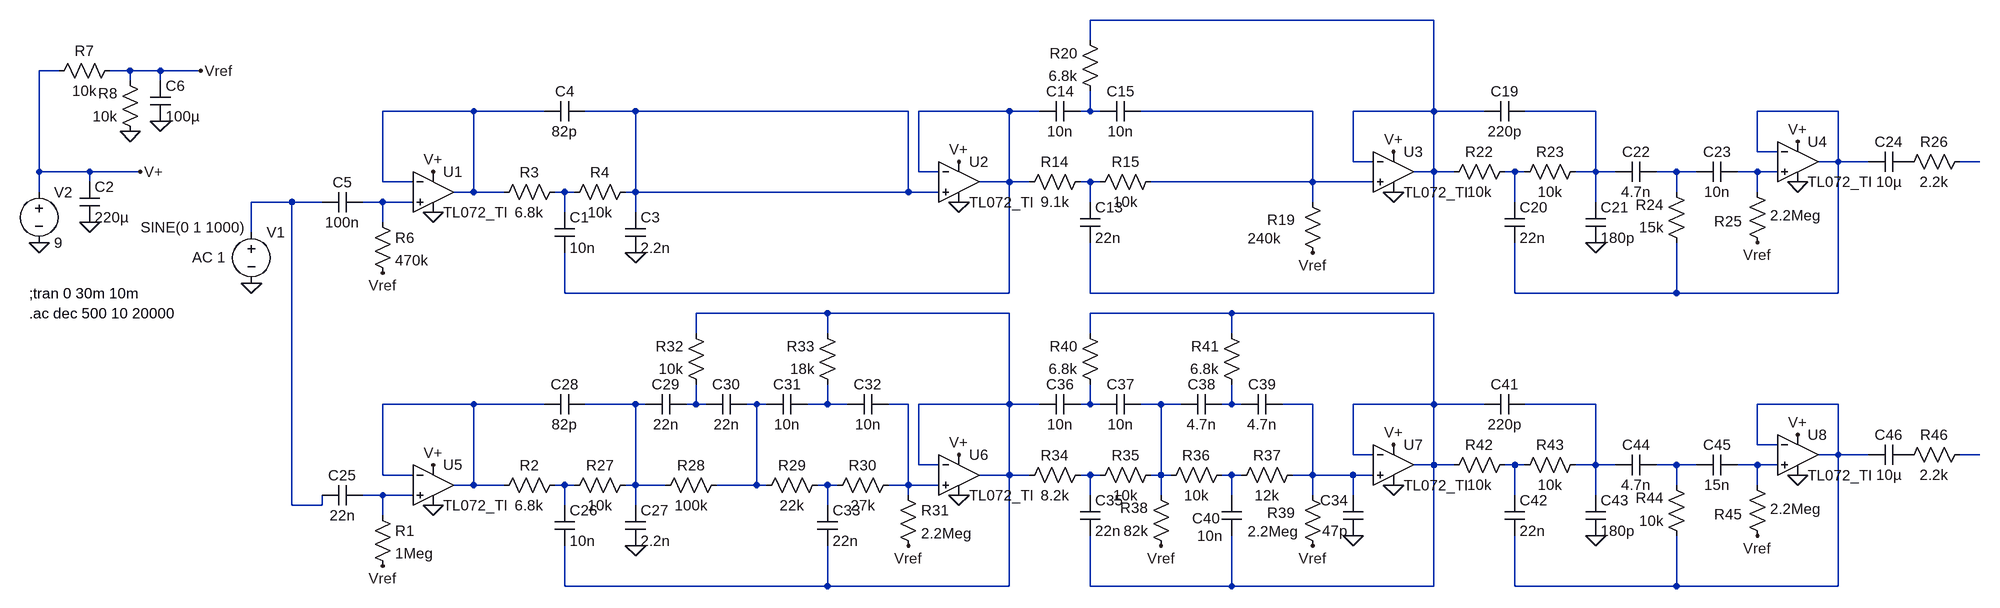
[diagram p0: schematic speakersim_true_val.asc]
speakersim_true_val.asc, the LTspice schematic file:
Version 4
SHEET 1 4328 1400
WIRE 2176 0 1632 0
WIRE 1632 32 1632 0
WIRE 0 80 -32 80
WIRE 112 80 80 80
WIRE 160 80 112 80
WIRE 224 80 160 80
WIRE 112 96 112 80
WIRE 160 96 160 80
WIRE 656 144 512 144
WIRE 768 144 656 144
WIRE 912 144 832 144
WIRE 1344 144 912 144
WIRE 1504 144 1360 144
WIRE 1552 144 1504 144
WIRE 1632 144 1632 112
WIRE 1632 144 1616 144
WIRE 1648 144 1632 144
WIRE 1984 144 1712 144
WIRE 2176 144 2176 0
WIRE 2176 144 2048 144
WIRE 2256 144 2176 144
WIRE 2432 144 2320 144
WIRE 2816 144 2688 144
WIRE 2688 208 2688 144
WIRE 2720 208 2688 208
WIRE 2048 224 2048 144
WIRE 2080 224 2048 224
WIRE 2816 224 2816 144
WIRE 2816 224 2784 224
WIRE 2864 224 2816 224
WIRE 3040 224 3008 224
WIRE -32 240 -32 80
WIRE 48 240 -32 240
WIRE 128 240 48 240
WIRE 1360 240 1360 144
WIRE 1392 240 1360 240
WIRE 2176 240 2176 144
WIRE 2176 240 2144 240
WIRE 2208 240 2176 240
WIRE 2304 240 2288 240
WIRE 2320 240 2304 240
WIRE 2432 240 2432 144
WIRE 2432 240 2400 240
WIRE 2464 240 2432 240
WIRE 2560 240 2528 240
WIRE 2592 240 2560 240
WIRE 2688 240 2656 240
WIRE 2720 240 2688 240
WIRE 48 256 48 240
WIRE 512 256 512 144
WIRE 560 256 512 256
WIRE 1504 256 1504 144
WIRE 1504 256 1456 256
WIRE 1536 256 1504 256
WIRE 1632 256 1616 256
WIRE 1648 256 1632 256
WIRE 1984 256 1984 144
WIRE 1984 256 1728 256
WIRE 2080 256 1984 256
WIRE -32 272 -32 240
WIRE 656 272 656 144
WIRE 656 272 624 272
WIRE 704 272 656 272
WIRE 800 272 784 272
WIRE 816 272 800 272
WIRE 912 272 912 144
WIRE 912 272 896 272
WIRE 1344 272 1344 144
WIRE 1344 272 912 272
WIRE 1392 272 1344 272
WIRE 2560 272 2560 240
WIRE 2688 272 2688 240
WIRE 368 288 304 288
WIRE 416 288 368 288
WIRE 512 288 480 288
WIRE 560 288 512 288
WIRE 1632 288 1632 256
WIRE 1984 288 1984 256
WIRE 2304 288 2304 240
WIRE 2432 288 2432 240
WIRE 800 304 800 272
WIRE 912 304 912 272
WIRE 512 320 512 288
WIRE 304 336 304 288
WIRE 800 432 800 368
WIRE 1504 432 1504 256
WIRE 1504 432 800 432
WIRE 1632 432 1632 352
WIRE 2176 432 2176 240
WIRE 2176 432 1632 432
WIRE 2304 432 2304 352
WIRE 2560 432 2560 352
WIRE 2560 432 2304 432
WIRE 2816 432 2816 224
WIRE 2816 432 2560 432
WIRE 1216 464 1008 464
WIRE 1504 464 1216 464
WIRE 1856 464 1632 464
WIRE 2176 464 1856 464
WIRE 1008 496 1008 464
WIRE 1216 496 1216 464
WIRE 1632 496 1632 464
WIRE 1856 496 1856 464
WIRE 656 608 512 608
WIRE 768 608 656 608
WIRE 912 608 832 608
WIRE 928 608 912 608
WIRE 1008 608 1008 576
WIRE 1008 608 992 608
WIRE 1024 608 1008 608
WIRE 1104 608 1088 608
WIRE 1120 608 1104 608
WIRE 1216 608 1216 576
WIRE 1216 608 1184 608
WIRE 1248 608 1216 608
WIRE 1344 608 1312 608
WIRE 1504 608 1504 464
WIRE 1504 608 1360 608
WIRE 1552 608 1504 608
WIRE 1632 608 1632 576
WIRE 1632 608 1616 608
WIRE 1648 608 1632 608
WIRE 1744 608 1712 608
WIRE 1776 608 1744 608
WIRE 1856 608 1856 576
WIRE 1856 608 1840 608
WIRE 1872 608 1856 608
WIRE 1984 608 1936 608
WIRE 2176 608 2176 464
WIRE 2176 608 2048 608
WIRE 2256 608 2176 608
WIRE 2432 608 2320 608
WIRE 2816 608 2688 608
WIRE 2688 672 2688 608
WIRE 2720 672 2688 672
WIRE 2048 688 2048 608
WIRE 2080 688 2048 688
WIRE 2816 688 2816 608
WIRE 2816 688 2784 688
WIRE 2864 688 2816 688
WIRE 3040 688 3008 688
WIRE 1360 704 1360 608
WIRE 1392 704 1360 704
WIRE 2176 704 2176 608
WIRE 2176 704 2144 704
WIRE 2208 704 2176 704
WIRE 2304 704 2288 704
WIRE 2320 704 2304 704
WIRE 2432 704 2432 608
WIRE 2432 704 2400 704
WIRE 2464 704 2432 704
WIRE 2560 704 2528 704
WIRE 2592 704 2560 704
WIRE 2688 704 2656 704
WIRE 2720 704 2688 704
WIRE 512 720 512 608
WIRE 560 720 512 720
WIRE 1504 720 1504 608
WIRE 1504 720 1456 720
WIRE 1536 720 1504 720
WIRE 1632 720 1616 720
WIRE 1648 720 1632 720
WIRE 1744 720 1744 608
WIRE 1744 720 1728 720
WIRE 1760 720 1744 720
WIRE 1856 720 1840 720
WIRE 1872 720 1856 720
WIRE 1984 720 1984 608
WIRE 1984 720 1952 720
WIRE 2048 720 1984 720
WIRE 2080 720 2048 720
WIRE 656 736 656 608
WIRE 656 736 624 736
WIRE 704 736 656 736
WIRE 800 736 784 736
WIRE 816 736 800 736
WIRE 912 736 912 608
WIRE 912 736 896 736
WIRE 960 736 912 736
WIRE 1104 736 1104 608
WIRE 1104 736 1040 736
WIRE 1120 736 1104 736
WIRE 1216 736 1200 736
WIRE 1232 736 1216 736
WIRE 1344 736 1344 608
WIRE 1344 736 1312 736
WIRE 1392 736 1344 736
WIRE 2560 736 2560 704
WIRE 2688 736 2688 704
WIRE 512 752 480 752
WIRE 560 752 512 752
WIRE 1344 752 1344 736
WIRE 1632 752 1632 720
WIRE 1744 752 1744 720
WIRE 1856 752 1856 720
WIRE 1984 752 1984 720
WIRE 2048 752 2048 720
WIRE 2304 752 2304 704
WIRE 2432 752 2432 704
WIRE 368 768 368 288
WIRE 416 768 416 752
WIRE 416 768 368 768
WIRE 800 768 800 736
WIRE 912 768 912 736
WIRE 1216 768 1216 736
WIRE 512 784 512 752
WIRE 800 896 800 832
WIRE 1216 896 1216 832
WIRE 1216 896 800 896
WIRE 1504 896 1504 720
WIRE 1504 896 1216 896
WIRE 1632 896 1632 816
WIRE 1856 896 1856 816
WIRE 1856 896 1632 896
WIRE 2176 896 2176 704
WIRE 2176 896 1856 896
WIRE 2304 896 2304 816
WIRE 2560 896 2560 816
WIRE 2560 896 2304 896
WIRE 2816 896 2816 688
WIRE 2816 896 2560 896
FLAG 304 416 0
FLAG -32 352 0
FLAG 128 240 V+
FLAG 48 320 0
FLAG 112 176 0
FLAG 160 160 0
FLAG 224 80 Vref
FLAG 592 240 V+
FLAG 592 304 0
FLAG 512 400 Vref
FLAG 912 368 0
FLAG 1424 224 V+
FLAG 1424 288 0
FLAG 1984 368 Vref
FLAG 2112 208 V+
FLAG 2112 272 0
FLAG 2432 352 0
FLAG 2688 352 Vref
FLAG 2752 192 V+
FLAG 2752 256 0
FLAG 592 704 V+
FLAG 592 768 0
FLAG 512 864 Vref
FLAG 912 832 0
FLAG 1424 688 V+
FLAG 1424 752 0
FLAG 1344 832 Vref
FLAG 1744 832 Vref
FLAG 1984 832 Vref
FLAG 2048 816 0
FLAG 2112 672 V+
FLAG 2112 736 0
FLAG 2432 816 0
FLAG 2688 816 Vref
FLAG 2752 656 V+
FLAG 2752 720 0
SYMBOL voltage 304 320 R0
WINDOW 123 -94 55 Left 2
WINDOW 39 0 0 Left 2
WINDOW 3 -175 8 Left 2
SYMATTR Value2 AC 1
SYMATTR Value SINE(0 1 1000)
SYMATTR InstName V1
SYMBOL voltage -32 256 R0
WINDOW 123 0 0 Left 2
WINDOW 39 0 0 Left 2
SYMATTR InstName V2
SYMATTR Value 9
SYMBOL cap 32 256 R0
SYMATTR InstName C2
SYMATTR Value 220µ
SYMBOL res 96 64 R90
WINDOW 0 0 56 VBottom 2
WINDOW 3 32 56 VTop 2
SYMATTR InstName R7
SYMATTR Value 10k
SYMBOL res 128 192 R180
WINDOW 0 36 76 Left 2
WINDOW 3 36 40 Left 2
SYMATTR InstName R8
SYMATTR Value 10k
SYMBOL cap 144 96 R0
SYMATTR InstName C6
SYMATTR Value 100µ
SYMBOL EXTRA\\AudioOpamp\\TI\\TL072_TI 592 272 R0
SYMATTR InstName U1
SYMBOL cap 480 272 R90
WINDOW 0 0 32 VBottom 2
WINDOW 3 32 32 VTop 2
SYMATTR InstName C5
SYMATTR Value 100n
SYMBOL res 496 304 R0
SYMATTR InstName R6
SYMATTR Value 470k
SYMBOL res 800 256 R90
WINDOW 0 0 56 VBottom 2
WINDOW 3 32 56 VTop 2
SYMATTR InstName R3
SYMATTR Value 6.8k
SYMBOL res 912 256 R90
WINDOW 0 0 56 VBottom 2
WINDOW 3 32 56 VTop 2
SYMATTR InstName R4
SYMATTR Value 10k
SYMBOL cap 784 304 R0
SYMATTR InstName C1
SYMATTR Value 10n
SYMBOL cap 896 304 R0
SYMATTR InstName C3
SYMATTR Value 2.2n
SYMBOL cap 832 128 R90
WINDOW 0 0 32 VBottom 2
WINDOW 3 32 32 VTop 2
SYMATTR InstName C4
SYMATTR Value 82p
SYMBOL EXTRA\\AudioOpamp\\TI\\TL072_TI 1424 256 R0
SYMATTR InstName U2
SYMBOL res 1632 240 R90
WINDOW 0 0 56 VBottom 2
WINDOW 3 32 56 VTop 2
SYMATTR InstName R14
SYMATTR Value 9.1k
SYMBOL res 1744 240 R90
WINDOW 0 0 56 VBottom 2
WINDOW 3 32 56 VTop 2
SYMATTR InstName R15
SYMATTR Value 10k
SYMBOL res 1968 272 R0
WINDOW 0 -56 44 Left 2
WINDOW 3 -87 73 Left 2
SYMATTR InstName R19
SYMATTR Value 240k
SYMBOL EXTRA\\AudioOpamp\\TI\\TL072_TI 2112 240 R0
SYMATTR InstName U3
SYMBOL cap 1616 288 R0
SYMATTR InstName C13
SYMATTR Value 22n
SYMBOL cap 1616 128 R90
WINDOW 0 0 32 VBottom 2
WINDOW 3 32 32 VTop 2
SYMATTR InstName C14
SYMATTR Value 10n
SYMBOL cap 1712 128 R90
WINDOW 0 0 32 VBottom 2
WINDOW 3 32 32 VTop 2
SYMATTR InstName C15
SYMATTR Value 10n
SYMBOL res 1648 128 R180
WINDOW 0 36 76 Left 2
WINDOW 3 36 40 Left 2
SYMATTR InstName R20
SYMATTR Value 6.8k
SYMBOL res 2304 224 R90
WINDOW 0 0 56 VBottom 2
WINDOW 3 32 56 VTop 2
SYMATTR InstName R22
SYMATTR Value 10k
SYMBOL res 2416 224 R90
WINDOW 0 0 56 VBottom 2
WINDOW 3 32 56 VTop 2
SYMATTR InstName R23
SYMATTR Value 10k
SYMBOL cap 2256 160 R270
WINDOW 0 32 32 VTop 2
WINDOW 3 0 32 VBottom 2
SYMATTR InstName C19
SYMATTR Value 220p
SYMBOL cap 2288 288 R0
SYMATTR InstName C20
SYMATTR Value 22n
SYMBOL cap 2416 288 R0
SYMATTR InstName C21
SYMATTR Value 180p
SYMBOL cap 2528 224 R90
WINDOW 0 0 32 VBottom 2
WINDOW 3 32 32 VTop 2
SYMATTR InstName C22
SYMATTR Value 4.7n
SYMBOL cap 2656 224 R90
WINDOW 0 0 32 VBottom 2
WINDOW 3 32 32 VTop 2
SYMATTR InstName C23
SYMATTR Value 10n
SYMBOL res 2576 368 R180
WINDOW 0 36 76 Left 2
WINDOW 3 36 40 Left 2
SYMATTR InstName R24
SYMATTR Value 15k
SYMBOL res 2672 256 R0
WINDOW 0 -52 62 Left 2
WINDOW 3 36 53 Left 2
SYMATTR InstName R25
SYMATTR Value 2.2Meg
SYMBOL EXTRA\\AudioOpamp\\TI\\TL072_TI 2752 224 R0
SYMATTR InstName U4
SYMBOL cap 2928 208 R90
WINDOW 0 0 32 VBottom 2
WINDOW 3 32 32 VTop 2
SYMATTR InstName C24
SYMATTR Value 10µ
SYMBOL res 3024 208 R90
WINDOW 0 0 56 VBottom 2
WINDOW 3 32 56 VTop 2
SYMATTR InstName R26
SYMATTR Value 2.2k
SYMBOL EXTRA\\AudioOpamp\\TI\\TL072_TI 592 736 R0
SYMATTR InstName U5
SYMBOL cap 480 736 R90
WINDOW 0 0 32 VBottom 2
WINDOW 3 32 32 VTop 2
SYMATTR InstName C25
SYMATTR Value 22n
SYMBOL res 496 768 R0
SYMATTR InstName R1
SYMATTR Value 1Meg
SYMBOL res 800 720 R90
WINDOW 0 0 56 VBottom 2
WINDOW 3 32 56 VTop 2
SYMATTR InstName R2
SYMATTR Value 6.8k
SYMBOL res 912 720 R90
WINDOW 0 0 56 VBottom 2
WINDOW 3 32 56 VTop 2
SYMATTR InstName R27
SYMATTR Value 10k
SYMBOL cap 784 768 R0
SYMATTR InstName C26
SYMATTR Value 10n
SYMBOL cap 896 768 R0
SYMATTR InstName C27
SYMATTR Value 2.2n
SYMBOL res 1056 720 R90
WINDOW 0 0 56 VBottom 2
WINDOW 3 32 56 VTop 2
SYMATTR InstName R28
SYMATTR Value 100k
SYMBOL cap 832 592 R90
WINDOW 0 0 32 VBottom 2
WINDOW 3 32 32 VTop 2
SYMATTR InstName C28
SYMATTR Value 82p
SYMBOL cap 992 592 R90
WINDOW 0 0 32 VBottom 2
WINDOW 3 32 32 VTop 2
SYMATTR InstName C29
SYMATTR Value 22n
SYMBOL cap 1088 592 R90
WINDOW 0 0 32 VBottom 2
WINDOW 3 32 32 VTop 2
SYMATTR InstName C30
SYMATTR Value 22n
SYMBOL res 1216 720 R90
WINDOW 0 0 56 VBottom 2
WINDOW 3 32 56 VTop 2
SYMATTR InstName R29
SYMATTR Value 22k
SYMBOL cap 1184 592 R90
WINDOW 0 0 32 VBottom 2
WINDOW 3 32 32 VTop 2
SYMATTR InstName C31
SYMATTR Value 10n
SYMBOL cap 1312 592 R90
WINDOW 0 0 32 VBottom 2
WINDOW 3 32 32 VTop 2
SYMATTR InstName C32
SYMATTR Value 10n
SYMBOL res 1328 720 R90
WINDOW 0 0 56 VBottom 2
WINDOW 3 32 56 VTop 2
SYMATTR InstName R30
SYMATTR Value 27k
SYMBOL cap 1200 768 R0
SYMATTR InstName C33
SYMATTR Value 22n
SYMBOL res 1328 736 R0
SYMATTR InstName R31
SYMATTR Value 2.2Meg
SYMBOL EXTRA\\AudioOpamp\\TI\\TL072_TI 1424 720 R0
SYMATTR InstName U6
SYMBOL res 1024 592 R180
WINDOW 0 36 76 Left 2
WINDOW 3 36 40 Left 2
SYMATTR InstName R32
SYMATTR Value 10k
SYMBOL res 1232 592 R180
WINDOW 0 36 76 Left 2
WINDOW 3 36 40 Left 2
SYMATTR InstName R33
SYMATTR Value 18k
SYMBOL res 1632 704 R90
WINDOW 0 0 56 VBottom 2
WINDOW 3 32 56 VTop 2
SYMATTR InstName R34
SYMATTR Value 8.2k
SYMBOL res 1744 704 R90
WINDOW 0 0 56 VBottom 2
WINDOW 3 32 56 VTop 2
SYMATTR InstName R35
SYMATTR Value 10k
SYMBOL res 1856 704 R90
WINDOW 0 0 56 VBottom 2
WINDOW 3 32 56 VTop 2
SYMATTR InstName R36
SYMATTR Value 10k
SYMBOL res 1968 704 R90
WINDOW 0 0 56 VBottom 2
WINDOW 3 32 56 VTop 2
SYMATTR InstName R37
SYMATTR Value 12k
SYMBOL res 1760 848 R180
WINDOW 0 36 76 Left 2
WINDOW 3 36 40 Left 2
SYMATTR InstName R38
SYMATTR Value 82k
SYMBOL res 1968 736 R0
WINDOW 0 -56 44 Left 2
WINDOW 3 -87 73 Left 2
SYMATTR InstName R39
SYMATTR Value 2.2Meg
SYMBOL cap 2064 816 R180
WINDOW 0 24 56 Left 2
WINDOW 3 24 8 Left 2
SYMATTR InstName C34
SYMATTR Value 47p
SYMBOL EXTRA\\AudioOpamp\\TI\\TL072_TI 2112 704 R0
SYMATTR InstName U7
SYMBOL cap 1616 752 R0
SYMATTR InstName C35
SYMATTR Value 22n
SYMBOL cap 1616 592 R90
WINDOW 0 0 32 VBottom 2
WINDOW 3 32 32 VTop 2
SYMATTR InstName C36
SYMATTR Value 10n
SYMBOL cap 1712 592 R90
WINDOW 0 0 32 VBottom 2
WINDOW 3 32 32 VTop 2
SYMATTR InstName C37
SYMATTR Value 10n
SYMBOL cap 1840 592 R90
WINDOW 0 0 32 VBottom 2
WINDOW 3 32 32 VTop 2
SYMATTR InstName C38
SYMATTR Value 4.7n
SYMBOL cap 1936 592 R90
WINDOW 0 0 32 VBottom 2
WINDOW 3 32 32 VTop 2
SYMATTR InstName C39
SYMATTR Value 4.7n
SYMBOL res 1648 592 R180
WINDOW 0 36 76 Left 2
WINDOW 3 36 40 Left 2
SYMATTR InstName R40
SYMATTR Value 6.8k
SYMBOL res 1872 592 R180
WINDOW 0 36 76 Left 2
WINDOW 3 36 40 Left 2
SYMATTR InstName R41
SYMATTR Value 6.8k
SYMBOL cap 1840 752 R0
WINDOW 0 -47 36 Left 2
WINDOW 3 -39 64 Left 2
SYMATTR InstName C40
SYMATTR Value 10n
SYMBOL res 2304 688 R90
WINDOW 0 0 56 VBottom 2
WINDOW 3 32 56 VTop 2
SYMATTR InstName R42
SYMATTR Value 10k
SYMBOL res 2416 688 R90
WINDOW 0 0 56 VBottom 2
WINDOW 3 32 56 VTop 2
SYMATTR InstName R43
SYMATTR Value 10k
SYMBOL cap 2256 624 R270
WINDOW 0 32 32 VTop 2
WINDOW 3 0 32 VBottom 2
SYMATTR InstName C41
SYMATTR Value 220p
SYMBOL cap 2288 752 R0
SYMATTR InstName C42
SYMATTR Value 22n
SYMBOL cap 2416 752 R0
SYMATTR InstName C43
SYMATTR Value 180p
SYMBOL cap 2528 688 R90
WINDOW 0 0 32 VBottom 2
WINDOW 3 32 32 VTop 2
SYMATTR InstName C44
SYMATTR Value 4.7n
SYMBOL cap 2656 688 R90
WINDOW 0 0 32 VBottom 2
WINDOW 3 32 32 VTop 2
SYMATTR InstName C45
SYMATTR Value 15n
SYMBOL res 2576 832 R180
WINDOW 0 36 76 Left 2
WINDOW 3 36 40 Left 2
SYMATTR InstName R44
SYMATTR Value 10k
SYMBOL res 2672 720 R0
WINDOW 0 -52 62 Left 2
WINDOW 3 36 53 Left 2
SYMATTR InstName R45
SYMATTR Value 2.2Meg
SYMBOL EXTRA\\AudioOpamp\\TI\\TL072_TI 2752 688 R0
SYMATTR InstName U8
SYMBOL cap 2928 672 R90
WINDOW 0 0 32 VBottom 2
WINDOW 3 32 32 VTop 2
SYMATTR InstName C46
SYMATTR Value 10µ
SYMBOL res 3024 672 R90
WINDOW 0 0 56 VBottom 2
WINDOW 3 32 56 VTop 2
SYMATTR InstName R46
SYMATTR Value 2.2k
TEXT -48 432 Left 2 !;tran 0 30m 10m
TEXT -48 464 Left 2 !.ac dec 500 10 20000

The netlist it stands for:
* speakersim_true_val.asc
V1 N015 0 SINE(0 1 1000) AC 1
V2 V+ 0 9
C2 V+ 0 220µ
R7 Vref V+ 10k
R8 0 Vref 10k
C6 Vref 0 100µ
* U1: TL072_TI (symbol EXTRA\AudioOpamp\TI\TL072_TI not available, pins judged from their places): In+=N016 In-=N002 V+=V+ V-=0 OUT=N002
C5 N016 N015 100n
R6 N016 Vref 470k
R3 N014 N002 6.8k
R4 N003 N014 10k
C1 N014 N004 10n
C3 N003 0 2.2n
C4 N003 N002 82p
* U2: TL072_TI (symbol EXTRA\AudioOpamp\TI\TL072_TI not available, pins judged from their places): In+=N003 In-=N004 V+=V+ V-=0 OUT=N004
R14 N013 N004 9.1k
R15 N006 N013 10k
R19 N006 Vref 240k
* U3: TL072_TI (symbol EXTRA\AudioOpamp\TI\TL072_TI not available, pins judged from their places): In+=N006 In-=N001 V+=V+ V-=0 OUT=N001
C13 N013 N001 22n
C14 N005 N004 10n
C15 N006 N005 10n
R20 N005 N001 6.8k
R22 N010 N001 10k
R23 N007 N010 10k
C19 N001 N007 220p
C20 N010 N008 22n
C21 N007 0 180p
C22 N011 N007 4.7n
C23 N012 N011 10n
R24 N008 N011 15k
R25 N012 Vref 2.2Meg
* U4: TL072_TI (symbol EXTRA\AudioOpamp\TI\TL072_TI not available, pins judged from their places): In+=N012 In-=N008 V+=V+ V-=0 OUT=N008
C24 P001 N008 10µ
R26 N009 P001 2.2k
* U5: TL072_TI (symbol EXTRA\AudioOpamp\TI\TL072_TI not available, pins judged from their places): In+=N039 In-=N019 V+=V+ V-=0 OUT=N019
C25 N039 N015 22n
R1 N039 Vref 1Meg
R2 N037 N019 6.8k
R27 N020 N037 10k
C26 N037 N017 10n
C27 N020 0 2.2n
R28 N022 N020 100k
C28 N020 N019 82p
C29 N021 N020 22n
C30 N022 N021 22n
R29 N038 N022 22k
C31 N023 N022 10n
C32 N024 N023 10n
R30 N024 N038 27k
C33 N038 N017 22n
R31 N024 Vref 2.2Meg
* U6: TL072_TI (symbol EXTRA\AudioOpamp\TI\TL072_TI not available, pins judged from their places): In+=N024 In-=N017 V+=V+ V-=0 OUT=N017
R32 N021 N017 10k
R33 N023 N017 18k
R34 N035 N017 8.2k
R35 N026 N035 10k
R36 N036 N026 10k
R37 N028 N036 12k
R38 Vref N026 82k
R39 N028 Vref 2.2Meg
C34 0 N028 47p
* U7: TL072_TI (symbol EXTRA\AudioOpamp\TI\TL072_TI not available, pins judged from their places): In+=N028 In-=N018 V+=V+ V-=0 OUT=N018
C35 N035 N018 22n
C36 N025 N017 10n
C37 N026 N025 10n
C38 N027 N026 4.7n
C39 N028 N027 4.7n
R40 N025 N018 6.8k
R41 N027 N018 6.8k
C40 N036 N018 10n
R42 N032 N018 10k
R43 N029 N032 10k
C41 N018 N029 220p
C42 N032 N030 22n
C43 N029 0 180p
C44 N033 N029 4.7n
C45 N034 N033 15n
R44 N030 N033 10k
R45 N034 Vref 2.2Meg
* U8: TL072_TI (symbol EXTRA\AudioOpamp\TI\TL072_TI not available, pins judged from their places): In+=N034 In-=N030 V+=V+ V-=0 OUT=N030
C46 P002 N030 10µ
R46 N031 P002 2.2k
;tran 0 30m 10m
.ac dec 500 10 20000
.backanno
.end